# EAGLE schematic vialShine (EAGLE 7.3.0)

## Sheet 1 of 2
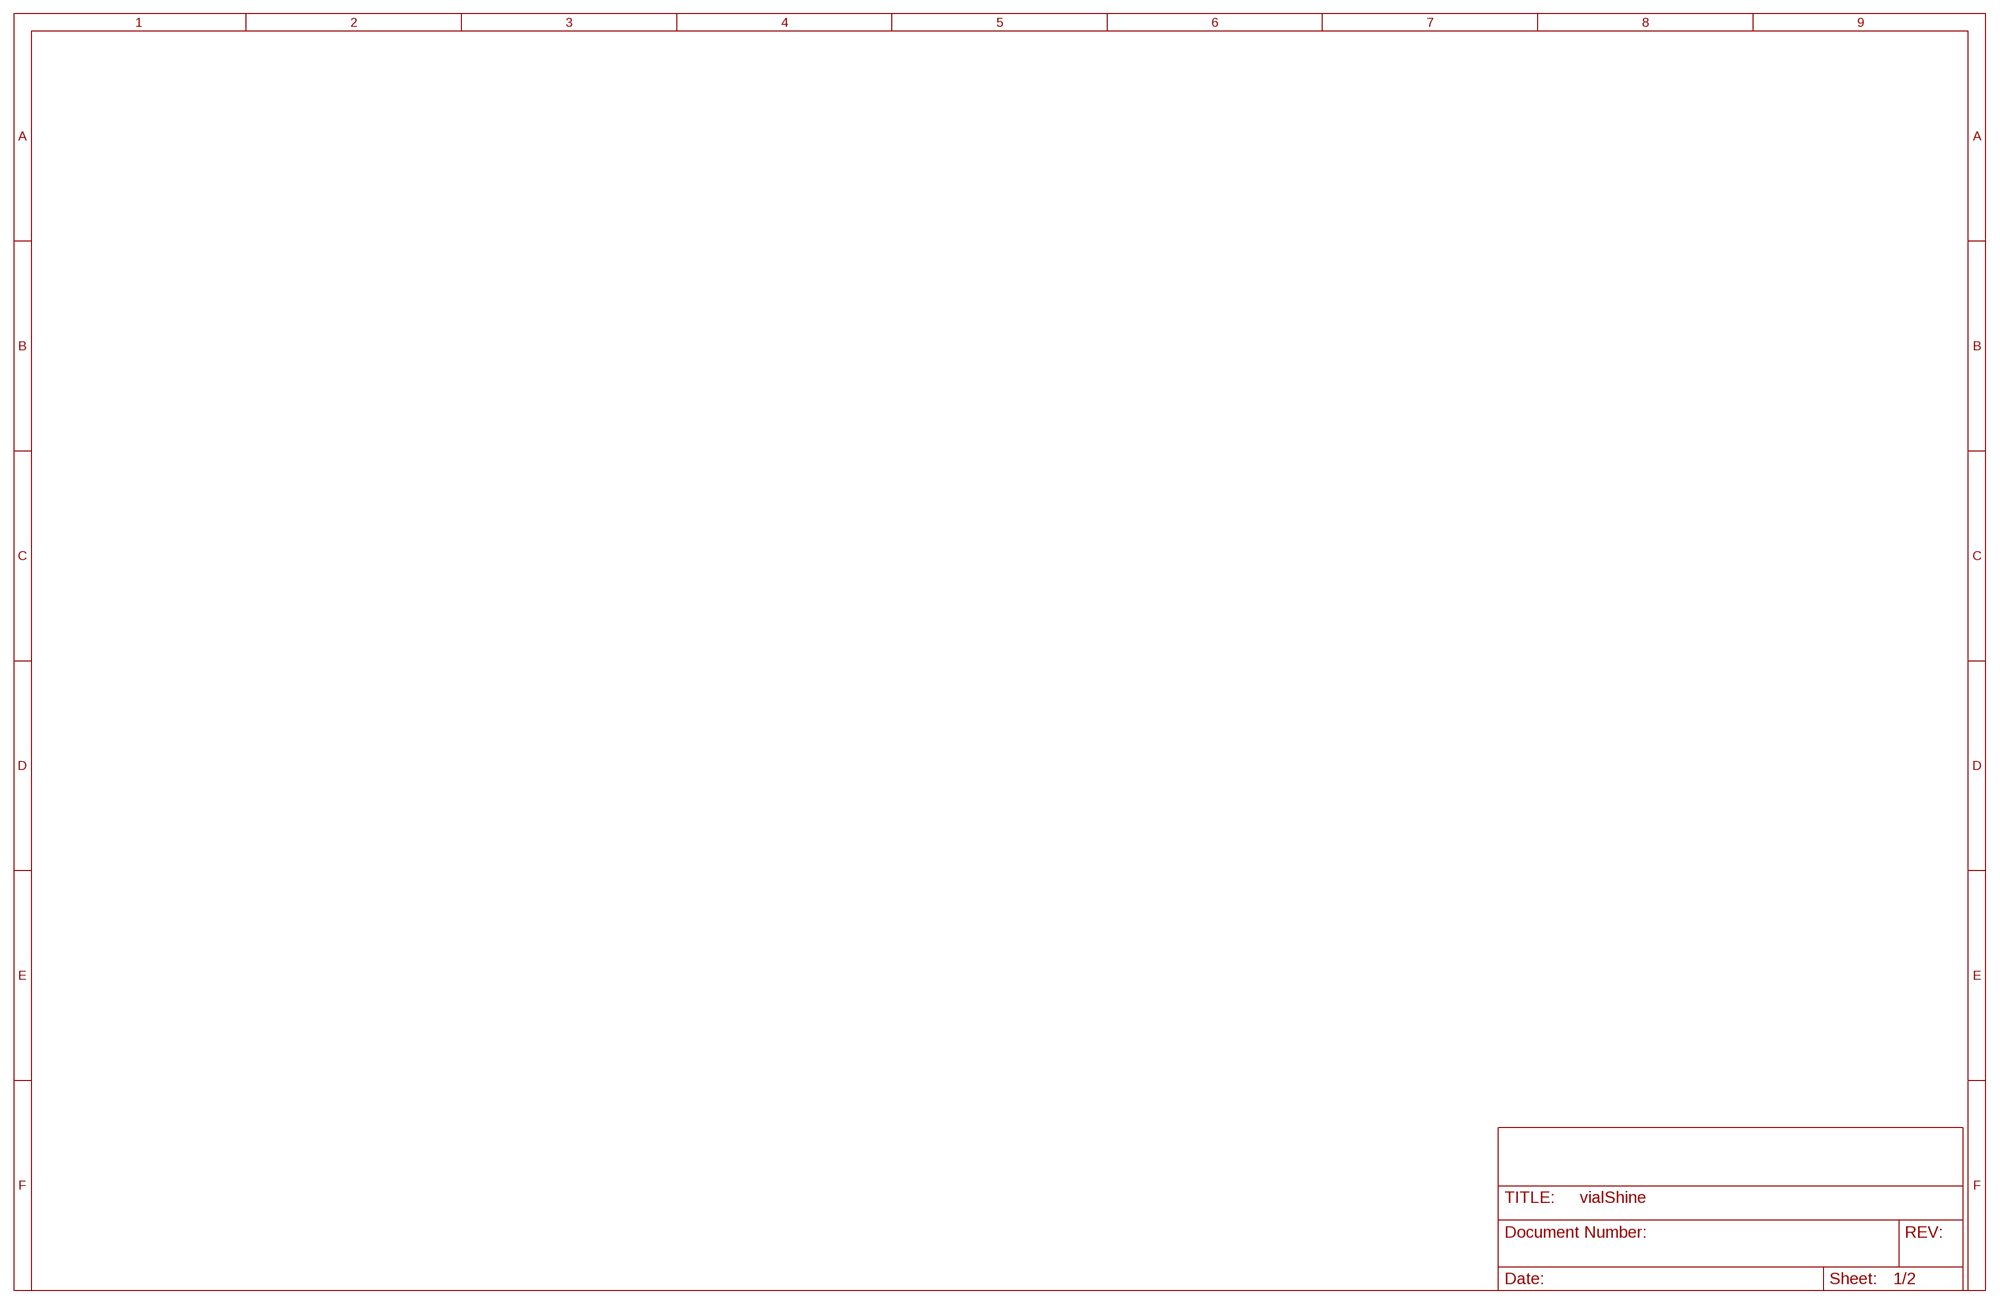
[diagram p0: schematic, sheet 1]

## Sheet 2 of 2
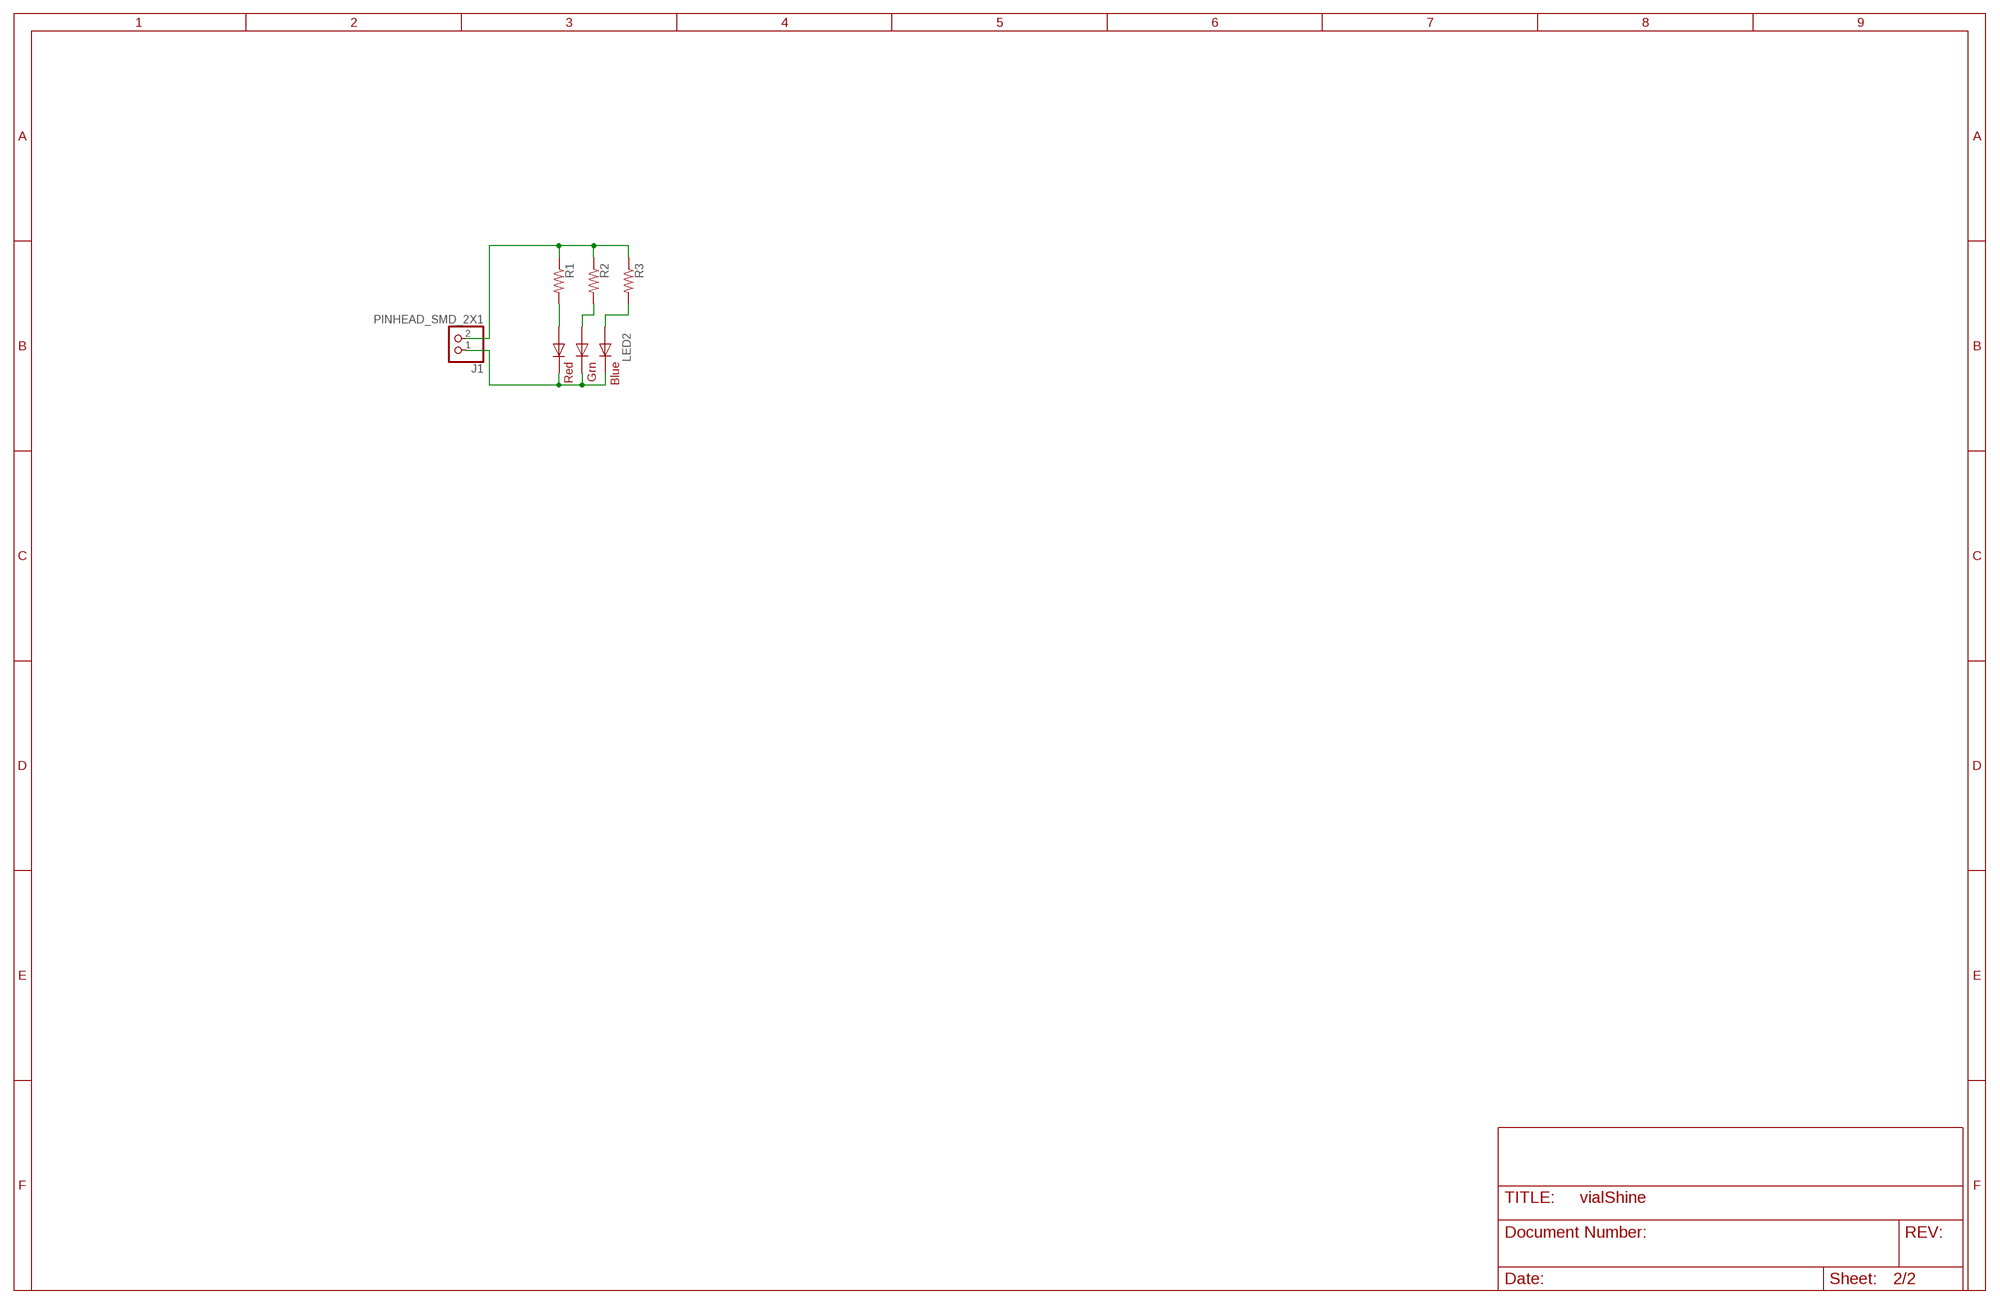
[diagram p1: schematic, sheet 2]

### Parts
J1  PINHEAD_SMD_2X1  [PINHEAD_SMD_2X1]
LED2  RGBLED5050  [RGBLED5050]
R1  R-US_R0603  [R0603]
R2  R-US_R0603  [R0603]
R3  R-US_R0603  [R0603]

### Nets
N$1: LED2.3(BLUE_A) R3.2
N$2: J1.2 R1.1 R2.1 R3.1
N$3: J1.1 LED2.4(BLUE_C) LED2.5(RED_C) LED2.6(GREEN_C)
N$4: LED2.2(RED_A) R1.2
N$5: LED2.1(GREEN_A) R2.2

## Library data of the parts
J1 = vialShine:PINHEAD_SMD_2X1
LED2 = adafruit:RGBLED: For 5050 RGB LEDs, the order of the LEDs may vary from one manufacturer to another!
R1-R3 = rcl:R-US_: RESISTOR, American symbol